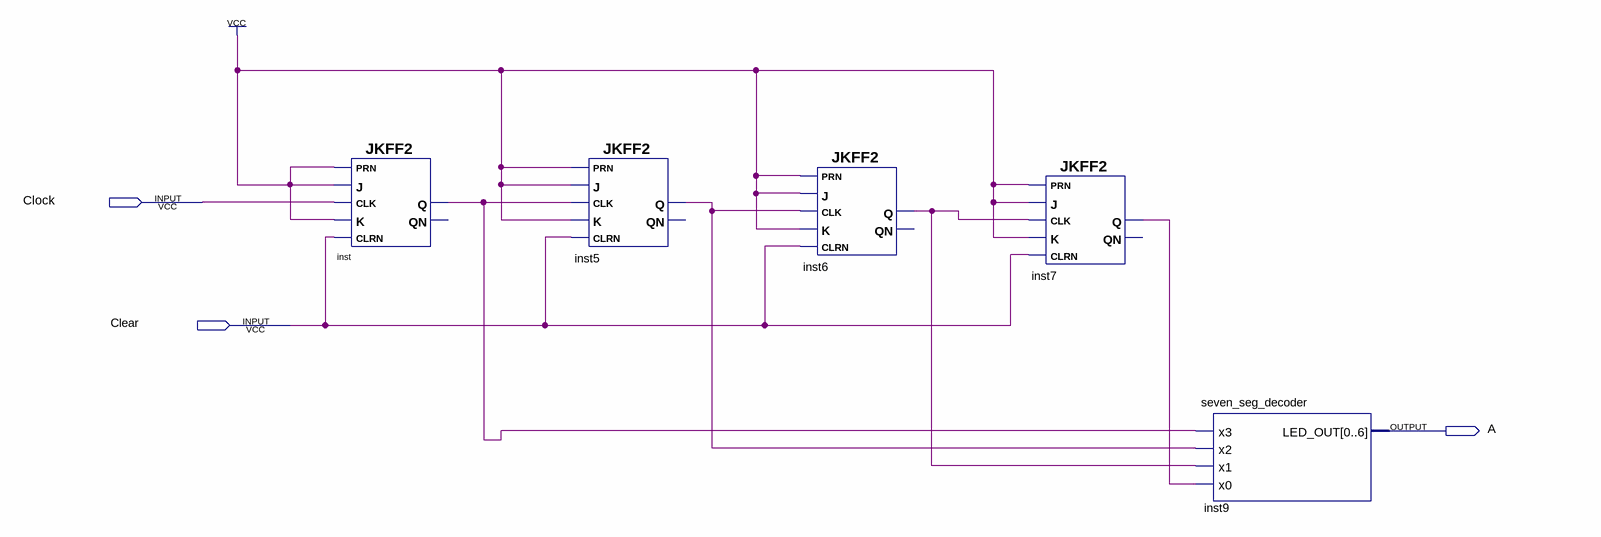
[diagram p0: schematic sheet]
// Quartus schematic lab10step3b.bdf as structural Verilog: 5 symbols, 3 pins
module lab10step3b (
  input  Clock,
  input  Clear,
  output A
);

  wire inst5_q, inst6_q, inst7_q, inst_q;

  JKFF2 inst (.K(1'b1), .CLRN(Clear), .CLK(Clock), .PRN(1'b1), .J(1'b1), .Q(inst_q));  // open: QN
  JKFF2 inst5 (.K(1'b1), .CLRN(Clear), .CLK(inst_q), .PRN(1'b1), .J(1'b1), .Q(inst5_q));  // open: QN
  JKFF2 inst6 (.K(1'b1), .CLRN(Clear), .CLK(inst5_q), .PRN(1'b1), .J(1'b1), .Q(inst6_q));  // open: QN
  JKFF2 inst7 (.K(1'b1), .CLRN(Clear), .CLK(inst6_q), .PRN(1'b1), .J(1'b1), .Q(inst7_q));  // open: QN
  seven_seg_decoder inst9 (.x3(inst_q), .x2(inst5_q), .x1(inst6_q), .x0(inst7_q), .LED_OUT(A));
endmodule
